# EAGLE schematic ADXL345_Breakout_V15panelize (EAGLE 6.5.0)
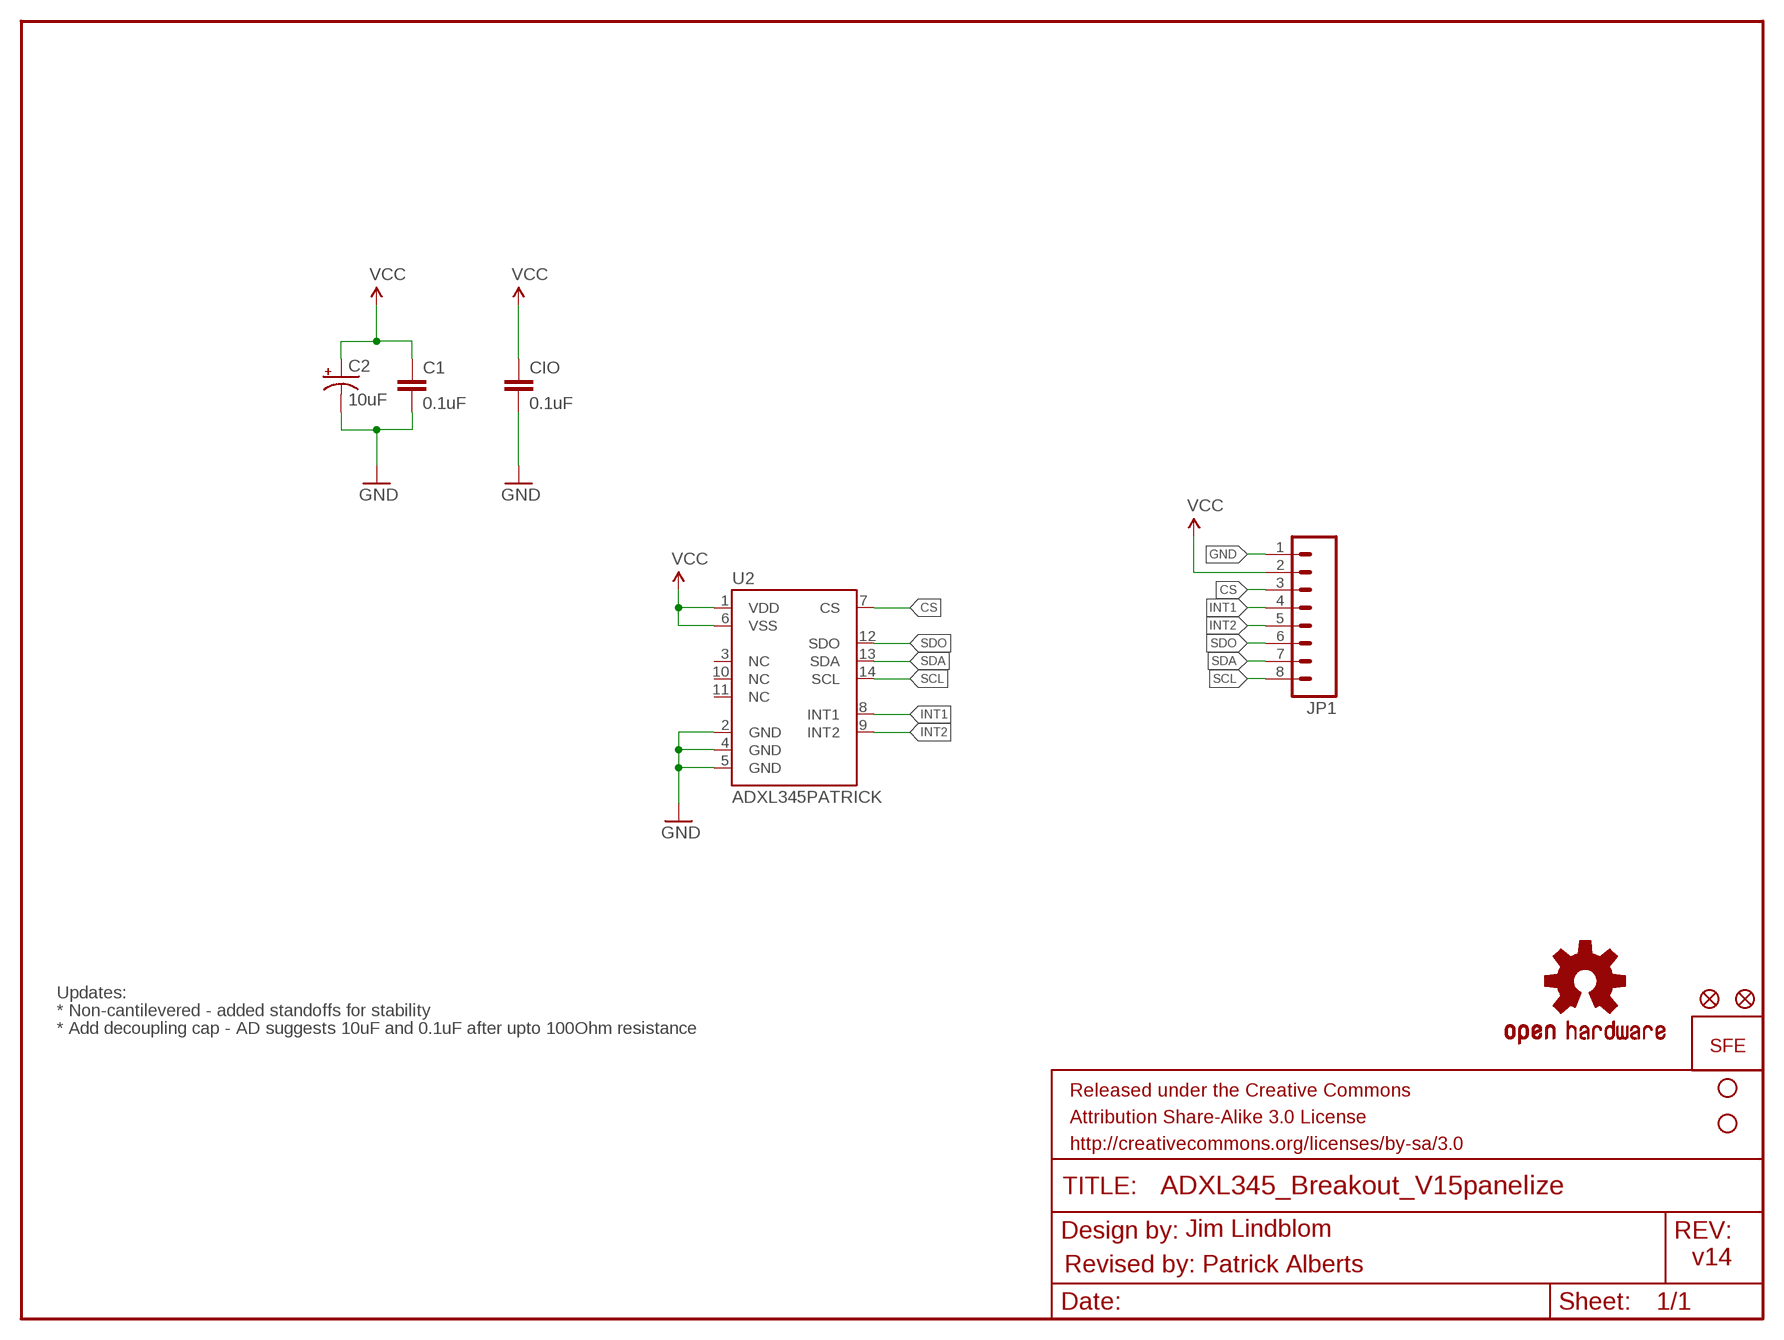
[diagram p0: schematic, sheet 1]

## Parts
C1  0.1uF  CAP0805  [0805]
C2  10uF  CAP_POL1206  [EIA3216]
CIO  0.1uF  CAP0805  [0805]
JP1  M081X08  [1X08]
JP2  STAND-OFF  [STAND-OFF]
JP3  STAND-OFF  [STAND-OFF]
JP4  FIDUCIAL1X2  [FIDUCIAL-1X2]
JP5  FIDUCIAL1X2  [FIDUCIAL-1X2]
U2  ADXL345PATRICK  [LGA14_1:1_PATRICK]
U$2  LOGO-SFENEW  [SFE-NEW-WEBLOGO]
U$3  OSHW-LOGOS  [OSHW-LOGO-S]

## Nets
CS: JP1.3 U2.7(CS)
GND: C1.2 C2.C(-) CIO.2 JP1.1 U2.2(GND) U2.4(GND) U2.5(GND)
INT1: JP1.4 U2.8(INT1)
INT2: JP1.5 U2.9(INT2)
SCL: JP1.8 U2.14(SCL)
SDA: JP1.7 U2.13(SDA)
SDO: JP1.6 U2.12(SDO)
VCC: C1.1 C2.A(+) CIO.1 JP1.2 U2.1(VDD) U2.6(VSS)
Unconnected: U2.3(NC) U2.10(NC) U2.11(NC)

## Notes on the sheet
- Updates:
- * Non-cantilevered - added standoffs for stability
- * Add decoupling cap - AD suggests 10uF and 0.1uF after upto 100Ohm resistance
- Jim Lindblom
- v14
- Revised by: Patrick Alberts

## Library data of the parts
C1 CIO = SparkFun:CAP: Capacitor Standard 0603 ceramic capacitor, and 0.1" leaded capacitor.
C2 = SparkFun:CAP_POL: Capacitor Polarized These are standard SMD and PTH capacitors. Normally 10uF, 47uF, and 100uF in electrolytic and tantalum varieties. Always verify the external diameter of the through hole cap, it varies with capacity, voltage, and manufacturer. The EIA devices should be standard.
JP1 = SparkFun:M08: Header 8 Standard 8-pin 0.1" header. Use with straight break away headers (SKU : PRT-00116), right angle break away headers (PRT-00553), swiss pins (PRT-00743), machine pins (PRT-00117), and female headers (PRT-00115).
JP2 JP3 = SparkFun:STAND-OFF: Stand Off This is the mechanical footprint for a #4 phillips button head screw. Use the keepout ring to avoid running the screw head into surrounding components. SKU : PRT-00447
JP4 JP5 = SparkFun-Aesthetics:FIDUCIAL: Fiducial Alignment Points Various fiducial points for machine vision alignment.
U2 = Testing:ADXL345
U$2 = SparkFun:LOGO-SFE: Spark Fun Electronics PCB Logo This is the standard Spark Fun Electronics PCB logo.
U$3 = SparkFun-Aesthetics:OSHW-LOGO: Open Source Hardware Logo This logo indicates the piece of hardware it is found on incorporates a OSHW license and/or adheres to the definition of open source hardware found here: http://freedomdefined.org/OSHW